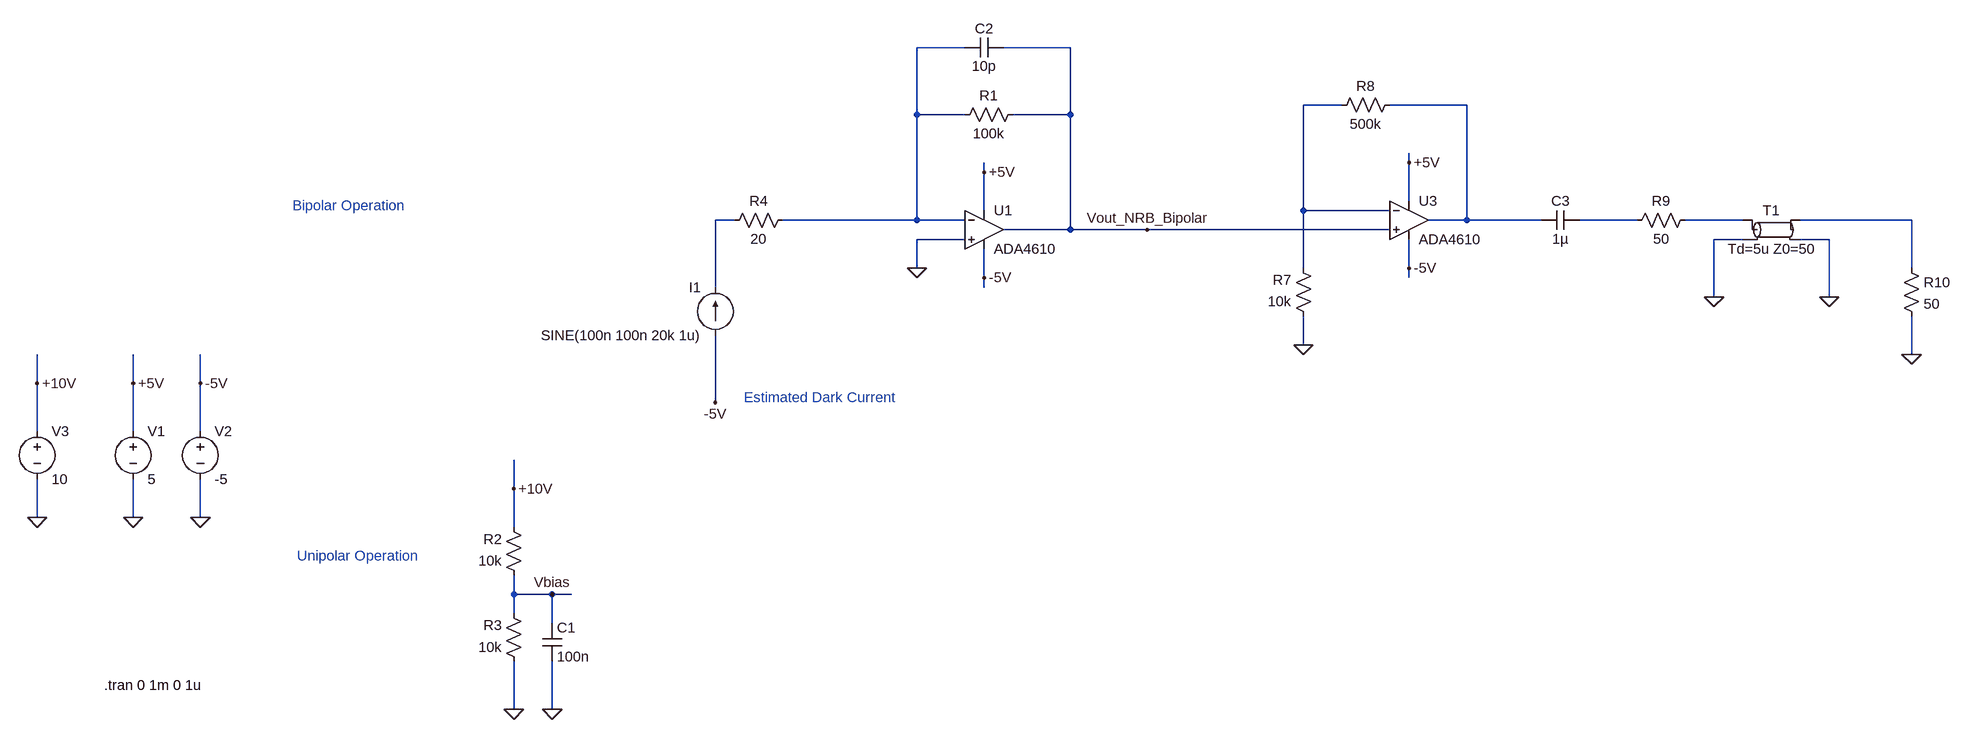
[diagram p0: schematic TIA_Preamp_Linedriver.asc]
TIA_Preamp_Linedriver.asc, the LTspice schematic file:
Version 4
SHEET 1 3412 768
WIRE 1232 -544 1152 -544
WIRE 1408 -544 1296 -544
WIRE 1872 -448 1808 -448
WIRE 2080 -448 1952 -448
WIRE 1152 -432 1152 -544
WIRE 1232 -432 1152 -432
WIRE 1408 -432 1408 -544
WIRE 1408 -432 1312 -432
WIRE 1984 -352 1984 -368
WIRE 1264 -336 1264 -352
WIRE 1984 -288 1984 -352
WIRE 1264 -272 1264 -336
WIRE 1808 -272 1808 -448
WIRE 1952 -272 1808 -272
WIRE 848 -256 816 -256
WIRE 1152 -256 1152 -432
WIRE 1152 -256 928 -256
WIRE 1232 -256 1152 -256
WIRE 2080 -256 2080 -448
WIRE 2080 -256 2016 -256
WIRE 2256 -256 2080 -256
WIRE 2416 -256 2320 -256
WIRE 2592 -256 2496 -256
WIRE 2880 -256 2688 -256
WIRE 1408 -240 1408 -432
WIRE 1408 -240 1296 -240
WIRE 1536 -240 1408 -240
WIRE 1952 -240 1536 -240
WIRE 1232 -224 1152 -224
WIRE 2592 -224 2544 -224
WIRE 2736 -224 2688 -224
WIRE 1152 -176 1152 -224
WIRE 1808 -176 1808 -272
WIRE 1984 -176 1984 -224
WIRE 2880 -176 2880 -256
WIRE 1264 -160 1264 -208
WIRE 1984 -160 1984 -176
WIRE 816 -144 816 -256
WIRE 1264 -144 1264 -160
WIRE 2544 -128 2544 -224
WIRE 2736 -128 2736 -224
WIRE 1808 -48 1808 -96
WIRE 2880 -32 2880 -96
WIRE -1008 16 -1008 -32
WIRE -848 16 -848 -32
WIRE -736 16 -736 -32
WIRE 816 48 816 -64
WIRE -1008 96 -1008 16
WIRE -848 96 -848 16
WIRE -736 96 -736 16
WIRE 480 192 480 144
WIRE -1008 240 -1008 176
WIRE -848 240 -848 176
WIRE -736 240 -736 176
WIRE 480 256 480 192
WIRE 480 368 480 336
WIRE 544 368 480 368
WIRE 576 368 544 368
WIRE 480 400 480 368
WIRE 544 416 544 368
WIRE 480 560 480 480
WIRE 544 560 544 480
FLAG -848 240 0
FLAG -848 16 +5V
FLAG -736 240 0
FLAG -736 16 -5V
FLAG 1264 -160 -5V
FLAG 1264 -336 +5V
FLAG 480 192 +10V
FLAG 544 368 Vbias
FLAG 544 560 0
FLAG 816 48 -5V
FLAG 1152 -176 0
FLAG 1536 -240 Vout_NRB_Bipolar
FLAG -1008 240 0
FLAG -1008 16 +10V
FLAG 480 560 0
FLAG 1984 -176 -5V
FLAG 1984 -352 +5V
FLAG 1808 -48 0
FLAG 2880 -32 0
FLAG 2544 -128 0
FLAG 2736 -128 0
SYMBOL OpAmps\\ADA4610 1264 -304 R0
SYMATTR InstName U1
SYMBOL voltage -848 80 R0
WINDOW 123 0 0 Left 0
WINDOW 39 0 0 Left 0
SYMATTR InstName V1
SYMATTR Value 5
SYMBOL voltage -736 80 R0
WINDOW 123 0 0 Left 0
WINDOW 39 0 0 Left 0
SYMATTR InstName V2
SYMATTR Value -5
SYMBOL res 1328 -448 R90
WINDOW 0 0 56 VBottom 2
WINDOW 3 32 56 VTop 2
SYMATTR InstName R1
SYMATTR Value 100k
SYMBOL res 496 352 R180
WINDOW 0 36 76 Left 2
WINDOW 3 36 40 Left 2
SYMATTR InstName R2
SYMATTR Value 10k
SYMBOL res 496 496 R180
WINDOW 0 36 76 Left 2
WINDOW 3 36 40 Left 2
SYMATTR InstName R3
SYMATTR Value 10k
SYMBOL cap 528 416 R0
SYMATTR InstName C1
SYMATTR Value 100n
SYMBOL cap 1232 -528 R270
WINDOW 0 32 32 VTop 2
WINDOW 3 0 32 VBottom 2
SYMATTR InstName C2
SYMATTR Value 10p
SYMBOL current 816 -64 R180
WINDOW 0 24 80 Left 2
WINDOW 3 24 0 Left 2
WINDOW 123 0 0 Left 0
WINDOW 39 0 0 Left 0
SYMATTR InstName I1
SYMATTR Value SINE(100n 100n 20k 1u)
SYMBOL res 944 -272 R90
WINDOW 0 0 56 VBottom 2
WINDOW 3 32 56 VTop 2
SYMATTR InstName R4
SYMATTR Value 20
SYMBOL voltage -1008 80 R0
WINDOW 123 0 0 Left 0
WINDOW 39 0 0 Left 0
SYMATTR InstName V3
SYMATTR Value 10
SYMBOL OpAmps\\ADA4610 1984 -320 R0
SYMATTR InstName U3
SYMBOL res 1824 -80 R180
WINDOW 0 36 76 Left 2
WINDOW 3 36 40 Left 2
SYMATTR InstName R7
SYMATTR Value 10k
SYMBOL res 1856 -432 R270
WINDOW 0 32 56 VTop 2
WINDOW 3 0 56 VBottom 2
SYMATTR InstName R8
SYMATTR Value 500k
SYMBOL res 2512 -272 R90
WINDOW 0 0 56 VBottom 2
WINDOW 3 32 56 VTop 2
SYMATTR InstName R9
SYMATTR Value 50
SYMBOL res 2864 -192 R0
SYMATTR InstName R10
SYMATTR Value 50
SYMBOL tline 2640 -240 R0
SYMATTR InstName T1
SYMATTR Value Td=5u Z0=50
SYMBOL cap 2256 -240 R270
WINDOW 0 32 32 VTop 2
WINDOW 3 0 32 VBottom 2
SYMATTR InstName C3
SYMATTR Value 1µ
TEXT -896 520 Left 2 !.tran 0 1m 0 1u
TEXT -144 -280 Left 2 ;Bipolar Operation
TEXT -136 304 Left 2 ;Unipolar Operation
TEXT 864 40 Left 2 ;Estimated Dark Current

The netlist it stands for:
* TIA_Preamp_Linedriver.asc
XU1 0 N001 +5V -5V Vout_NRB_Bipolar ADA4610  ; pins In+ In- V+ V- OUT
V1 +5V 0 5
V2 -5V 0 -5
R1 Vout_NRB_Bipolar N001 100k
R2 Vbias +10V 10k
R3 0 Vbias 10k
C1 Vbias 0 100n
C2 N001 Vout_NRB_Bipolar 10p
I1 -5V N004 SINE(100n 100n 20k 1u)
R4 N001 N004 20
V3 +10V 0 10
XU3 Vout_NRB_Bipolar N002 +5V -5V N003 ADA4610  ; pins In+ In- V+ V- OUT
R7 0 N002 10k
R8 N002 N003 500k
R9 N006 N005 50
R10 N007 0 50
T1 N006 0 N007 0 Td=5u Z0=50
C3 N003 N005 1µ
.tran 0 1m 0 1u
* Bipolar Operation
* Unipolar Operation
* Estimated Dark Current
.backanno
.end